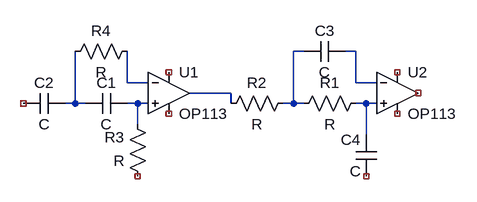
[diagram p0: schematic Draft1.asc]
Draft1.asc, the LTspice schematic file:
Version 4
SHEET 1 880 680
WIRE 320 96 304 96
WIRE 400 96 384 96
WIRE 48 144 48 96
WIRE 80 144 48 144
WIRE 400 144 400 96
WIRE 432 144 400 144
WIRE 208 160 144 160
WIRE -32 176 -32 96
WIRE -32 176 -48 176
WIRE -16 176 -32 176
WIRE 64 176 48 176
WIRE 80 176 64 176
WIRE 208 176 208 160
WIRE 304 176 304 96
WIRE 304 176 288 176
WIRE 320 176 304 176
WIRE 416 176 400 176
WIRE 432 176 416 176
WIRE 64 208 64 176
WIRE 416 224 416 176
SYMBOL OpAmps\\OP113 112 96 R0
SYMATTR InstName U1
SYMBOL OpAmps\\OP113 464 96 R0
SYMATTR InstName U2
SYMBOL cap 48 160 R90
WINDOW 0 0 32 VBottom 2
WINDOW 3 32 32 VTop 2
SYMATTR InstName C1
SYMBOL cap -48 160 R90
WINDOW 0 0 32 VBottom 2
WINDOW 3 32 32 VTop 2
SYMATTR InstName C2
SYMBOL cap 384 80 R90
WINDOW 0 0 32 VBottom 2
WINDOW 3 32 32 VTop 2
SYMATTR InstName C3
SYMBOL cap 432 288 R180
WINDOW 0 24 56 Left 2
WINDOW 3 24 8 Left 2
SYMATTR InstName C4
SYMBOL res 416 160 R90
WINDOW 0 0 56 VBottom 2
WINDOW 3 32 56 VTop 2
SYMATTR InstName R1
SYMBOL res 304 160 R90
WINDOW 0 0 56 VBottom 2
WINDOW 3 32 56 VTop 2
SYMATTR InstName R2
SYMBOL res 80 304 R180
WINDOW 0 36 76 Left 2
WINDOW 3 36 40 Left 2
SYMATTR InstName R3
SYMBOL res -48 112 R270
WINDOW 0 32 56 VTop 2
WINDOW 3 0 56 VBottom 2
SYMATTR InstName R4

The netlist it stands for:
* Draft1.asc
XU1 N006 N003 NC_01 NC_02 N004 OP113  ; pins In+ In- V+ V- OUT
XU2 N007 N002 NC_03 NC_04 NC_05 OP113  ; pins In+ In- V+ V- OUT
C1 N006 N005 C
C2 N005 NC_06 C
C3 N002 N001 C
C4 NC_07 N007 C
R1 N007 N001 R
R2 N001 N004 R
R3 NC_08 N006 R
R4 N005 N003 R
.lib ADI.lib
.backanno
.end